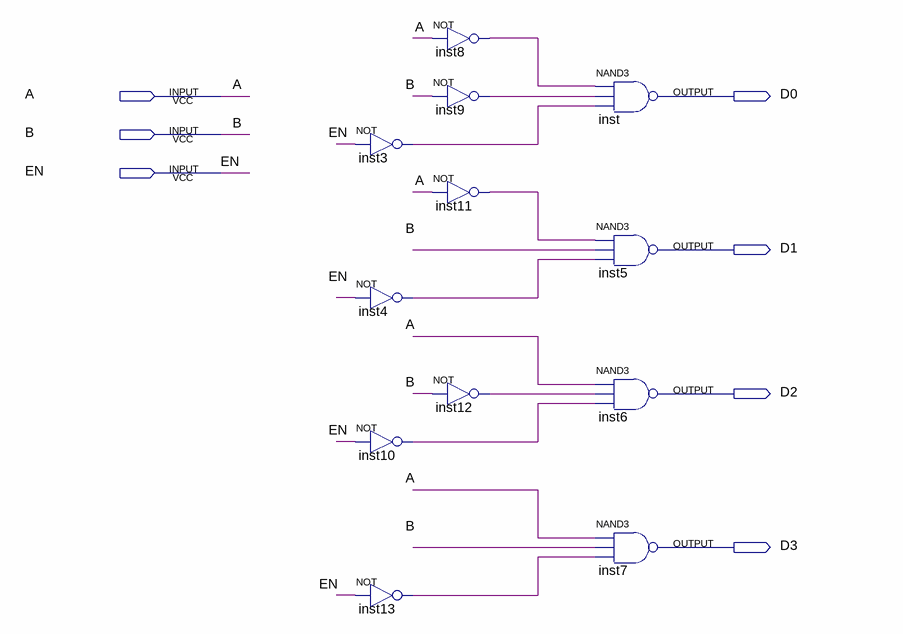
[diagram p0: schematic sheet]
// Quartus schematic Active_Low_Decoder.bdf as structural Verilog: 12 symbols, 7 pins
module Active_Low_Decoder (
  input  A,
  input  B,
  input  EN,
  output D0,
  output D1,
  output D2,
  output D3
);

  wire inst3_out, inst4_out, inst8_out, inst9_out, inst10_out, inst11_out, inst12_out, inst13_out;

  not inst3 (inst3_out, EN);
  not inst4 (inst4_out, EN);
  not inst10 (inst10_out, EN);
  not inst13 (inst13_out, EN);
  not inst8 (inst8_out, A);
  not inst9 (inst9_out, B);
  not inst11 (inst11_out, A);
  not inst12 (inst12_out, B);
  nand inst (D0, inst8_out, inst9_out, inst3_out);
  nand inst5 (D1, inst11_out, B, inst4_out);
  nand inst6 (D2, A, inst12_out, inst10_out);
  nand inst7 (D3, A, B, inst13_out);
endmodule
